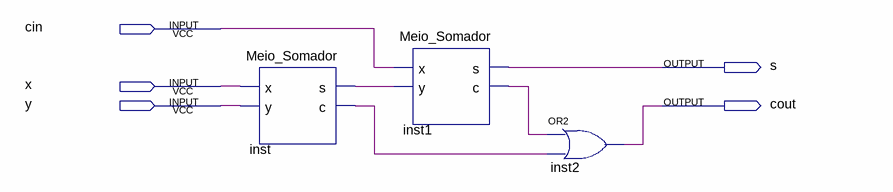
[diagram p0: schematic sheet]
// Quartus schematic Somado_Completo.bdf as structural Verilog: 3 symbols, 5 pins
module Somado_Completo (
  input  cin,
  input  x,
  input  y,
  output s,
  output cout
);

  wire inst1_c, inst_c, inst_s;

  Meio_Somador inst (.x(x), .y(y), .s(inst_s), .c(inst_c));
  Meio_Somador inst1 (.x(cin), .y(inst_s), .s(s), .c(inst1_c));
  or inst2 (cout, inst1_c, inst_c);
endmodule
